# Altium schematic sheet MP1584.SchDoc
size A3
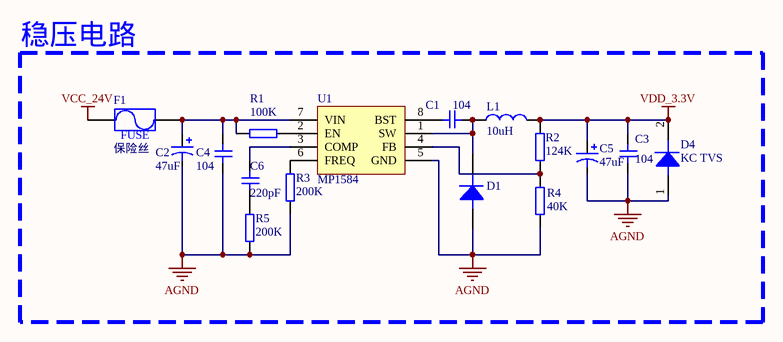
[diagram p0: MP1584.SchDoc]

## Parts
C1  104  [0805C]
C2  47uF  [TAJ-B]
C3  104  [0805C]
C4  104  [0805C]
C5  47uF  [TAJ-B]
C6  220pF  [0805C]
D1  (no value)  [SMBJ]
D4  KC TVS  [SMBJ]
F1  保险丝  [1812]
L1  10uH  [电感]
R1  100K  [0805R]
R2  124K  [0805R]
R3  200K  [0805R]
R4  40K  [0805R]
R5  200K  [0805R]
U1  MP1584

## Blocks framed on the sheet
稳压电路: C1-C6 D1 D4 F1 L1 R1-R5 U1

## Nets
AGND: C2.2 C3.1 C4.1 C5.2 D1.1 D4.1 R3.1 R4.1 R5.1 U1.5(GND)
VCC_24V: F1.1
VDD_3.3V: C3.2 C5.1 D4.2 L1.2 R2.1
NetC1_1: C1.1 D1.2 L1.1 U1.1(SW)
NetC1_2: C1.2 U1.8(BST)
NetC2_1: C2.1 C4.2 F1.2 R1.1 U1.7(VIN)
NetC6_1: C6.1 R5.2
NetC6_2: C6.2 U1.3(COMP)
NetR1_2: R1.2 U1.2(EN)
NetR2_2: R2.2 R4.2 U1.4(FB)
NetR3_2: R3.2 U1.6(FREQ)

## Notes on the sheet
- (in symbol Fuse) FUSE

## Library data of the parts
C1 C3 C4 C6 = Cap1: 无极贴片电容
C2 C5 = Pol Cap: 极性贴片电容
D1 D4 = Diode: 二极管
F1 = Fuse
L1 = L: 电感
R1-R5 = Res: 电阻